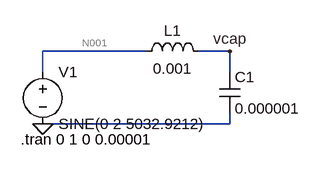
[diagram p0: schematic SeriesLC.asc]
SeriesLC.asc, the LTspice schematic file:
Version 4
SHEET 1 880 680
WIRE 128 112 -32 112
WIRE 256 112 208 112
WIRE -32 144 -32 112
WIRE 256 144 256 112
WIRE 256 224 256 208
WIRE 256 224 -32 224
FLAG -32 224 0
FLAG 256 112 vcap
SYMBOL ind 112 128 R270
WINDOW 0 32 56 VTop 2
WINDOW 3 5 56 VBottom 2
SYMATTR InstName L1
SYMATTR Value 0.001
SYMBOL cap 240 144 R0
SYMATTR InstName C1
SYMATTR Value 0.000001
SYMBOL voltage -32 128 R0
WINDOW 123 0 0 Left 2
WINDOW 39 0 0 Left 2
SYMATTR InstName V1
SYMATTR Value SINE(0 2 5032.9212)
TEXT -66 248 Left 2 !.tran 0 1 0 0.00001

The netlist it stands for:
* SeriesLC.asc
L1 N001 vcap 0.001
C1 vcap 0 0.000001
V1 N001 0 SINE(0 2 5032.9212)
.tran 0 1 0 0.00001
.backanno
.end

* Results of the author's LTspice run, read from the files saved beside the schematic
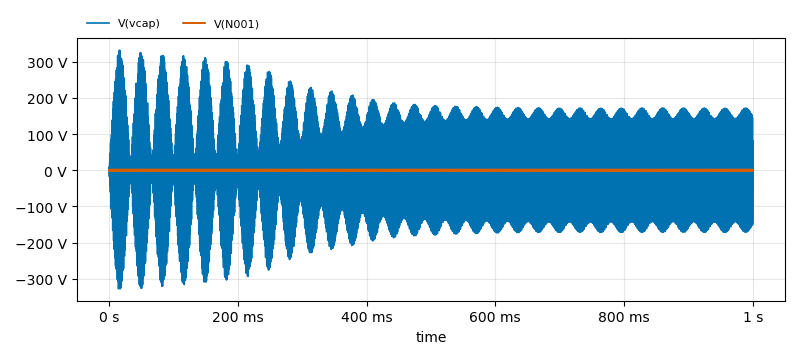
[diagram p1: Transient Analysis of SeriesLC.asc, plotted from the saved traces]
* Transient Analysis, 1 run:
*   V(vcap): min -332 V, max 332.3 V, average 5.39 mV, rms 125.2 V, last 81.44 V
*   V(N001): min -1.995 V, max 1.995 V, average -13.69 µV, rms 1.399 V, last -950.3 mV